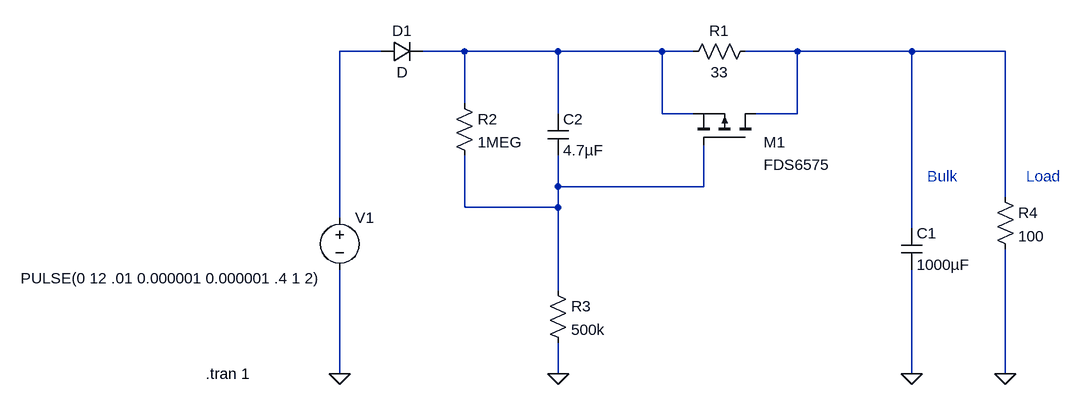
[diagram p0: schematic simulation.asc]
simulation.asc, the LTspice schematic file:
Version 4
SHEET 1 1300 680
WIRE 32 -144 -32 -144
WIRE 160 -144 96 -144
WIRE 304 -144 160 -144
WIRE 464 -144 304 -144
WIRE 512 -144 464 -144
WIRE 672 -144 592 -144
WIRE 848 -144 672 -144
WIRE 992 -144 848 -144
WIRE 160 -64 160 -144
WIRE 304 -48 304 -144
WIRE 464 -48 464 -144
WIRE 512 -48 464 -48
WIRE 672 -48 672 -144
WIRE 672 -48 608 -48
WIRE 304 64 304 16
WIRE 528 64 528 0
WIRE 528 64 304 64
WIRE 992 80 992 -144
WIRE 160 96 160 16
WIRE 304 96 304 64
WIRE 304 96 160 96
WIRE -32 112 -32 -144
WIRE 848 128 848 -144
WIRE 304 224 304 96
WIRE -32 352 -32 192
WIRE 304 352 304 304
WIRE 848 352 848 192
WIRE 992 352 992 160
FLAG 848 352 0
FLAG -32 352 0
FLAG 304 352 0
FLAG 992 352 0
SYMBOL voltage -32 96 R0
WINDOW 3 -25 109 Right 2
WINDOW 123 0 0 Left 2
WINDOW 39 0 0 Left 2
SYMATTR InstName V1
SYMATTR Value PULSE(0 12 .01 0.000001 0.000001 .4 1 2)
SYMBOL res 496 -128 R270
WINDOW 0 32 56 VTop 2
WINDOW 3 0 56 VBottom 2
SYMATTR InstName R1
SYMATTR Value 33
SYMBOL cap 832 128 R0
SYMATTR InstName C1
SYMATTR Value 1000µF
SYMBOL res 288 208 R0
SYMATTR InstName R3
SYMATTR Value 500k
SYMBOL cap 288 -48 R0
SYMATTR InstName C2
SYMATTR Value 4.7µF
SYMBOL res 976 64 R0
SYMATTR InstName R4
SYMATTR Value 100
SYMBOL diode 32 -128 R270
WINDOW 0 32 32 VTop 2
WINDOW 3 0 32 VBottom 2
SYMATTR InstName D1
SYMBOL pmos 608 0 M270
WINDOW 0 4 -12 VLeft 2
WINDOW 3 -30 -12 VLeft 2
SYMATTR InstName M1
SYMATTR Value FDS6575
SYMBOL res 144 -80 R0
SYMATTR InstName R2
SYMATTR Value 1MEG
TEXT 872 48 Left 2 ;Bulk
TEXT 1024 48 Left 2 ;Load
TEXT -238 352 Left 2 !.tran 1

The netlist it stands for:
* simulation.asc
V1 N001 0 PULSE(0 12 .01 0.000001 0.000001 .4 1 2)
R1 N002 N003 33
C1 N003 0 1000µF
R3 N004 0 500k
C2 N002 N004 4.7µF
R4 N003 0 100
D1 N001 N002 D
M1 N003 N004 N002 N002 FDS6575
R2 N002 N004 1MEG
.model D D
.lib standard.dio
.model NMOS NMOS
.model PMOS PMOS
.lib standard.mos
* Bulk
* Load
.tran 1
.backanno
.end